# Altium project VESC_6.PrjPcb
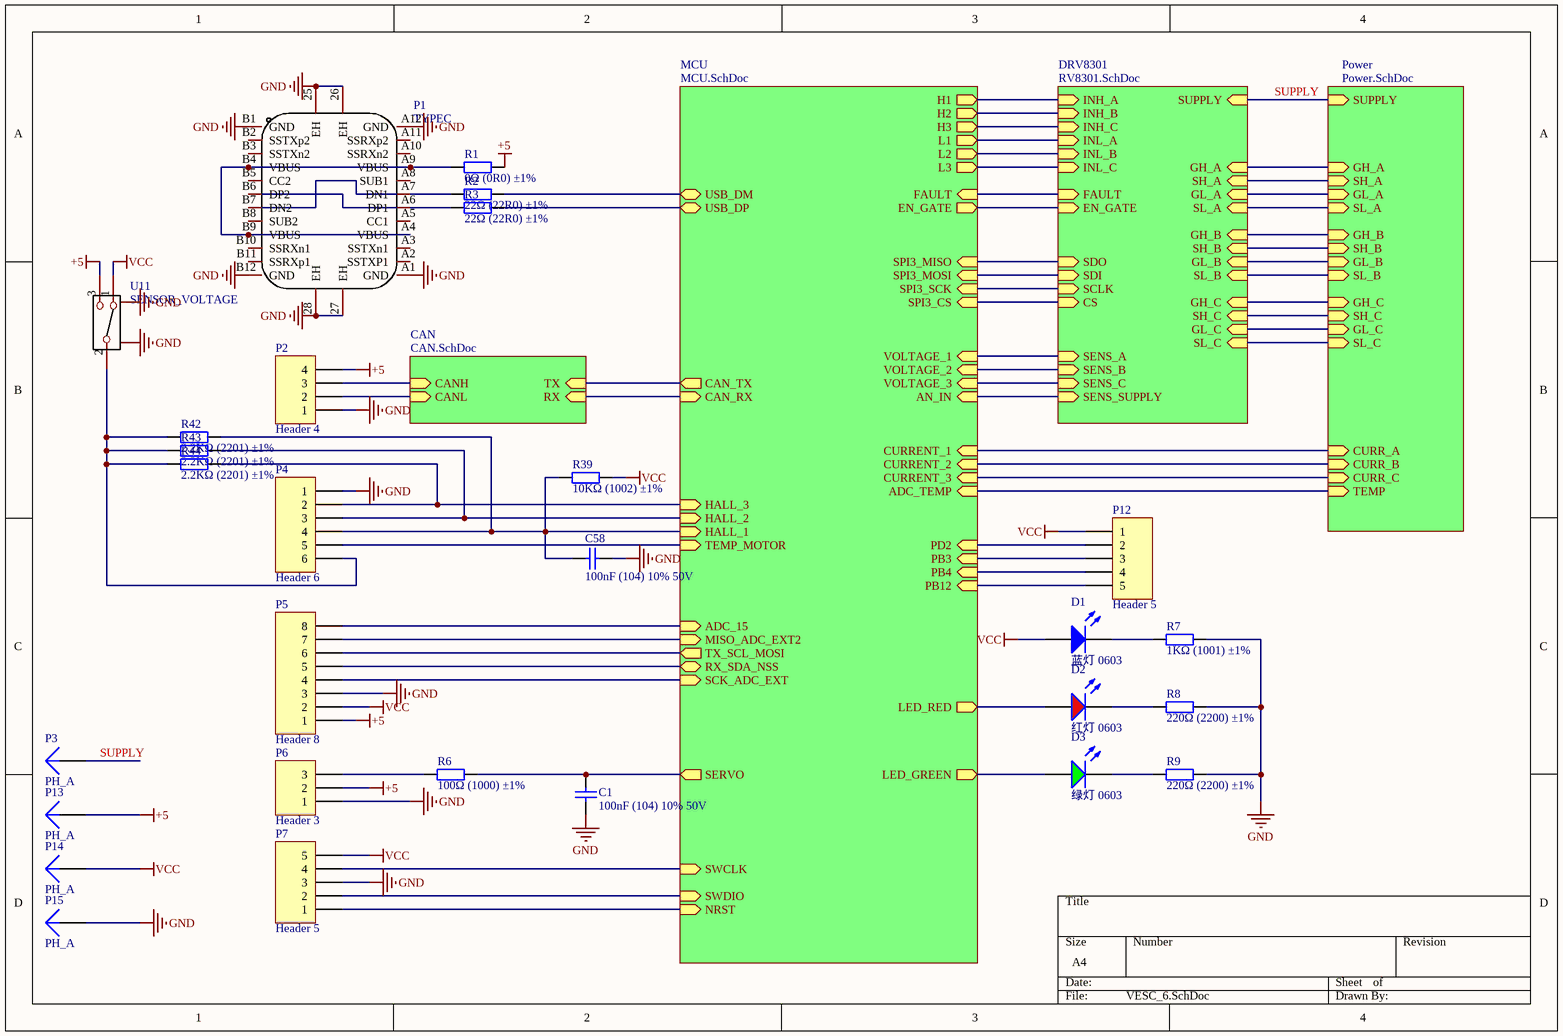
[diagram p0: VESC_6.SchDoc]
5 sheets, 126 parts. Net scope: hierarchical (ports join the sheet entries above them; power ports are global).
Board file: VESC_6.PcbDoc
Sheets:
  VESC_6.SchDoc
    CAN = CAN.SchDoc
    MCU = MCU.SchDoc
    DRV8301 = RV8301.SchDoc
    Power = Power.SchDoc

## Sheet VESC_6.SchDoc
size A4

### Parts
C1  100nF (104) 10% 50V  [0603_C]
C58  100nF (104) 10% 50V  [0603_C]
D1  蓝灯 0603  [0603_LED_S1]
D2  红灯 0603  [0603_LED_S1]
D3  绿灯 0603  [0603_LED_S1]
P1  TYPEC  [USB-C-SMD_TYPE-C-3.1-FEMALE-TH-9.3]
P2  Header 4  [PH-4A]
P3  PH_A  [Test PAD-3MM]
P4  Header 6  [PH-6A]
P5  Header 8  [PH-8A]
P6  Header 3  [PH-3A]
P7  Header 5  [PH-5A]
P12  Header 5  [HDR1X5]
P13  PH_A  [Test PAD-3MM]
P14  PH_A  [Test PAD-3MM]
P15  PH_A  [Test PAD-3MM]
R1  0Ω (0R0) ±1%  [0603_R]
R2  22Ω (22R0) ±1%  [0603_R]
R3  22Ω (22R0) ±1%  [0603_R]
R6  100Ω (1000) ±1%  [0603_R]
R7  1KΩ (1001) ±1%  [0603_R]
R8  220Ω (2200) ±1%  [0603_R]
R9  220Ω (2200) ±1%  [0603_R]
R39  10KΩ (1002) ±1%  [0603_R]
R42  2.2KΩ (2201) ±1%  [0603_R]
R43  2.2KΩ (2201) ±1%  [0603_R]
R44  2.2KΩ (2201) ±1%  [0603_R]
U11  SENSOR_VOLTAGE  [SENSOR_VOLTAGE]

### Sub-sheets
CAN = CAN.SchDoc: CANL (in), CANH (in), RX (in), TX (in)
DRV8301 = RV8301.SchDoc: CS (in), INL_C (in), GL_B (in), SENS_SUPPLY (in), INH_C (in), FAULT (in), SH_A (in), SH_B (in), SENS_B (in), SL_B (in), SCLK (in), SDO (in), GH_B (in), INH_A (in), SL_C (in), INL_A (in), GL_C (in), SENS_A (in), SDI (in), EN_GATE (in), GL_A (in), GH_C (in), INL_B (in), SH_C (in), INH_B (in), SL_A (in), SUPPLY (in), SENS_C (in), GH_A (in)
MCU = MCU.SchDoc: SWCLK (in), SPI3_SCK (in), MISO_ADC_EXT2 (in), LED_RED (out), CAN_RX (in), HALL_1 (in), H2 (out), CURRENT_2 (in), L2 (out), USB_DM (bidir), LED_GREEN (out), SPI3_CS (in), SPI3_MISO (in), FAULT (in), TX_SCL_MOSI (out), PB4 (in), CAN_TX (out), SCK_ADC_EXT (in), L3 (out), SWDIO (in), HALL_2 (in), SPI3_MOSI (in), PD2 (in), EN_GATE (out), ADC_TEMP (in), CURRENT_3 (in), SERVO (out), CURRENT_1 (in), ADC_15 (in), RX_SDA_NSS (bidir), L1 (out), H1 (out), H3 (out), PB3 (in), TEMP_MOTOR (in), HALL_3 (in), PB12 (in), USB_DP (bidir), NRST (in), VOLTAGE_1 (in), VOLTAGE_3 (in), AN_IN (in), VOLTAGE_2 (in)
Power = Power.SchDoc: SUPPLY (in), GH_B (in), SL_B (in), SL_A (in), GL_A (in), CURR_A (in), GL_B (in), SH_B (in), SH_C (in), SH_A (in), CURR_B (in), GH_A (in), SL_C (in), CURR_C (in), GH_C (in), TEMP (in), GL_C (in)

### Nets
+5: C1.1 C58.2 P1.25(EH) P1.26(EH) P1.27(EH) P1.28(EH) P1.A1(GND) P1.A12(GND) P1.B1(GND) P1.B12(GND) P2.1 P2.4 P4.1 P5.1 P5.3 P6.1 P6.2 P7.3 P13.1 P15.1 R1.2 R7.2 R8.2 R9.2 U11.3 U11.4 U11.5 ; sheet DRV8301/SL_B, sheet DRV8301/SL_C, sheet DRV8301/SL_A, sheet Power/SL_B, sheet Power/SL_A, sheet Power/SL_C  [also labelled GND]
VCC: D1.A P5.2 P7.5 P12.1 P14.1 R39.2 U11.1
RX_SDA_NSS: P5.5 ; sheet MCU/RX_SDA_NSS
SH_A: sheet DRV8301/SH_A, sheet Power/SH_A
SH_B: sheet DRV8301/SH_B, sheet Power/SH_B
SH_C: sheet DRV8301/SH_C, sheet Power/SH_C
SUPPLY: P3.1 ; sheet DRV8301/SUPPLY, sheet Power/SUPPLY
TX_SCL_MOSI: P5.6 ; sheet MCU/TX_SCL_MOSI
NetC1_2: C1.2 R6.2 ; sheet MCU/SERVO
NetC7_2: P7.1 ; sheet MCU/NRST
NetC29_2: sheet MCU/CURRENT_1, sheet Power/CURR_A
NetC30_2: sheet MCU/CURRENT_2, sheet Power/CURR_B
NetC36_2: sheet MCU/ADC_TEMP, sheet Power/TEMP
NetC45_2: sheet MCU/CURRENT_3, sheet Power/CURR_C
NetC58_1: C58.1 P4.4 R39.1 R42.2 ; sheet MCU/HALL_1
NetD1_K: D1.K R7.1
NetD2_A: D2.A ; sheet MCU/LED_RED
NetD2_K: D2.K R8.1
NetD3_A: D3.A ; sheet MCU/LED_GREEN
NetD3_K: D3.K R9.1
NetP1_A4: P1.A4(VBUS) P1.A9(VBUS) P1.B4(VBUS) P1.B9(VBUS) R1.1
NetP1_A6: P1.A6(DP1) R3.1
NetP1_A7: P1.A7(DN1) R2.1
NetP2_2: P2.2 ; sheet CAN/CANL
NetP2_3: P2.3 ; sheet CAN/CANH
NetP4_2: P4.2 R44.2 ; sheet MCU/HALL_3
NetP4_3: P4.3 R43.2 ; sheet MCU/HALL_2
NetP4_5: P4.5 ; sheet MCU/TEMP_MOTOR
NetP4_6: P4.6 R42.1 R43.1 R44.1 U11.2
NetP5_4: P5.4 ; sheet MCU/SCK_ADC_EXT
NetP5_7: P5.7 ; sheet MCU/MISO_ADC_EXT2
NetP5_8: P5.8 ; sheet MCU/ADC_15
NetP6_3: P6.3 R6.1
NetP7_2: P7.2 ; sheet MCU/SWDIO
NetP7_4: P7.4 ; sheet MCU/SWCLK
NetP12_2: P12.2 ; sheet MCU/PD2
NetP12_3: P12.3 ; sheet MCU/PB3
NetP12_4: P12.4 ; sheet MCU/PB4
NetP12_5: P12.5 ; sheet MCU/PB12
NetR2_2: R2.2 ; sheet MCU/USB_DM
NetR3_2: R3.2 ; sheet MCU/USB_DP
NetR15_1: sheet MCU/AN_IN, sheet DRV8301/SENS_SUPPLY
NetR17_1: sheet MCU/VOLTAGE_1, sheet DRV8301/SENS_A
NetR19_1: sheet MCU/VOLTAGE_2, sheet DRV8301/SENS_B
NetR21_1: sheet MCU/VOLTAGE_3, sheet DRV8301/SENS_C
NetR25_1: sheet DRV8301/GH_A, sheet Power/GH_A
NetR26_1: sheet DRV8301/GL_A, sheet Power/GL_A
NetR30_1: sheet DRV8301/GH_B, sheet Power/GH_B
NetR31_1: sheet DRV8301/GL_B, sheet Power/GL_B
NetR33_1: sheet DRV8301/GH_C, sheet Power/GH_C
NetR34_1: sheet DRV8301/GL_C, sheet Power/GL_C
NetU1_34: sheet MCU/L1, sheet DRV8301/INL_A
NetU1_35: sheet MCU/L2, sheet DRV8301/INL_B
NetU1_36: sheet MCU/L3, sheet DRV8301/INL_C
NetU1_40: sheet MCU/SPI3_CS, sheet DRV8301/CS
NetU1_41: sheet MCU/H1, sheet DRV8301/INH_A
NetU1_42: sheet MCU/H2, sheet DRV8301/INH_B
NetU1_43: sheet MCU/H3, sheet DRV8301/INH_C
NetU1_51: sheet MCU/SPI3_SCK, sheet DRV8301/SCLK
NetU1_52: sheet MCU/SPI3_MISO, sheet DRV8301/SDO
NetU1_53: sheet MCU/SPI3_MOSI, sheet DRV8301/SDI
NetU1_57: sheet MCU/EN_GATE, sheet DRV8301/EN_GATE
NetU1_59: sheet MCU/FAULT, sheet DRV8301/FAULT
NetU1_61: sheet CAN/RX, sheet MCU/CAN_RX
NetU1_62: sheet CAN/TX, sheet MCU/CAN_TX

Not connected (* = marked no-connect by the designer): P1 A2(SSTXP1) A3(SSTXn1) A5(CC1) A8(SUB1) A10(SSRXn2) A11(SSRXp2) B2(SSTXp2) B3(SSTXn2) B5(CC2) B6(DP2) B7(DN2) B8(SUB2) B10(SSRXn1) B11(SSRXp1)

### Library data of the parts
C1 C58 = 0603 100nF (104) 10% 50V: 贴片电容; ComponentLink1Description: 供应商链接; ComponentLink1URL: http://www.szlcsc.com/product/details_15331.html; Package: 0603; Supplier: LC; SuppliersPartNumber: C14663
D1 = 0603 蓝灯: 发光二极管; ComponentLink1Description: 供应商链接; ComponentLink1URL: http://www.szlcsc.com/product/details_73150.html; Package: 0603; Supplier: LC; SuppliersPartNumber: C72041
D2 = 0603 红灯: 发光二极管; ComponentLink1Description: 供应商链接; ComponentLink1URL: http://www.szlcsc.com/product/details_2659.html; Package: 0603; Supplier: LC; SuppliersPartNumber: C2286
D3 = 0603 绿灯: 发光二极管; ComponentLink1Description: 供应商链接; ComponentLink1URL: http://www.szlcsc.com/product/details_73152.html; Package: 0603; Supplier: LC; SuppliersPartNumber: C72043
P2 = Header 4: Header, 4-Pin; LatestRevisionDate: 17-Jul-2002; LatestRevisionNote: Re-released for DXP Platform.; Publisher: Altium Limited
P3 P13-P15 = Plug: LatestRevisionDate: 17-Jul-2002; LatestRevisionNote: Re-released for DXP Platform.; Publisher: Altium Limited
P4 = Header 6: Header, 6-Pin; LatestRevisionDate: 17-Jul-2002; LatestRevisionNote: Re-released for DXP Platform.; Publisher: Altium Limited
P5 = Header 8: Header, 8-Pin; LatestRevisionDate: 17-Jul-2002; LatestRevisionNote: Re-released for DXP Platform.; Publisher: Altium Limited
P6 = Header 3: Header, 3-Pin; LatestRevisionDate: 17-Jul-2002; LatestRevisionNote: Re-released for DXP Platform.; Publisher: Altium Limited
P7 P12 = Header 5: Header, 5-Pin; LatestRevisionDate: 17-Jul-2002; LatestRevisionNote: Re-released for DXP Platform.; Publisher: Altium Limited
R1 = 0603 0Ω (0R0) 1%: 贴片电阻; ComponentLink1Description: 供应商链接; ComponentLink1URL: http://www.szlcsc.com/product/details_21903.html; Package: 0603; Supplier: LC; SuppliersPartNumber: C21189
R2 R3 = 0603 22Ω (22R0) 1%: 贴片电阻; ComponentLink1Description: 供应商链接; ComponentLink1URL: http://www.szlcsc.com/product/details_24078.html; Package: 0603; Supplier: LC; SuppliersPartNumber: C23345
R6 = 0603 100Ω (1000) 1%: 贴片电阻; ComponentLink1Description: 供应商链接; ComponentLink1URL: http://www.szlcsc.com/product/details_23502.html; Package: 0603; Supplier: LC; SuppliersPartNumber: C22775
R7 = 0603 1KΩ (1001) 1%: 贴片电阻; ComponentLink1Description: 供应商链接; ComponentLink1URL: http://www.szlcsc.com/product/details_21904.html; Package: 0603; Supplier: LC; SuppliersPartNumber: C21190
R8 R9 = 0603 220Ω (2200) 1%: 贴片电阻; ComponentLink1Description: 供应商链接; ComponentLink1URL: http://www.szlcsc.com/product/details_23689.html; Package: 0603; Supplier: LC; SuppliersPartNumber: C22962
R39 = 0603 10KΩ (1002) 1%: 贴片电阻; ComponentLink1Description: 供应商链接; ComponentLink1URL: http://www.szlcsc.com/product/details_26547.html; Package: 0603; Supplier: LC; SuppliersPartNumber: C25804
R42-R44 = 0603 2.2KΩ (2201) 1%: 贴片电阻; ComponentLink1Description: 供应商链接; ComponentLink1URL: http://www.szlcsc.com/product/details_4597.html; Package: 0603; Supplier: LC; SuppliersPartNumber: C4190

## Sheet CAN.SchDoc
size A4
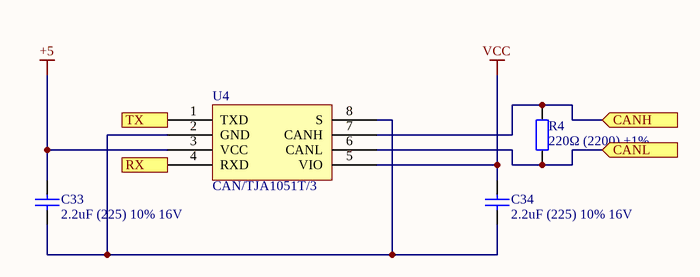
[diagram p1: CAN.SchDoc]

### Parts
C33  2.2uF (225) 10% 16V  [0603_C]
C34  2.2uF (225) 10% 16V  [0603_C]
R4  220Ω (2200) ±1%  [0603_R]
U4  CAN/TJA1051T/3  [SOIC-8_150mil]

### Ports
CANH (in), CANL (in), RX (in), TX (in)

### Nets
+5: C33.2 U4.3(VCC)
VCC: C34.2 U4.5(VIO)
NetC33_1: C33.1 C34.1 U4.2(GND) U4.8(S)
NetP2_2: R4.1 U4.6(CANL) ; port CANL
NetP2_3: R4.2 U4.7(CANH) ; port CANH
NetU1_61: U4.4(RXD) ; port RX
NetU1_62: U4.1(TXD) ; port TX

### Library data of the parts
C33 C34 = 0603 2.2uF (225) 10% 16V: 贴片电容; ComponentLink1Description: 供应商链接; ComponentLink1URL: http://www.szlcsc.com/product/details_24366.html; Package: 0603; Supplier: LC; SuppliersPartNumber: C23630
R4 = 0603 220Ω (2200) 1%: 贴片电阻; ComponentLink1Description: 供应商链接; ComponentLink1URL: http://www.szlcsc.com/product/details_23689.html; Package: 0603; Supplier: LC; SuppliersPartNumber: C22962
U4 = CAN/TJA1051T/3_[C38695]: CAN; ComponentLink1Description: 供应商链接; ComponentLink1URL: http://www.szlcsc.com/product/details_39678.html; Package: SOIC-8_150mil; Supplier: LC; SuppliersPartNumber: C38695

## Sheet MCU.SchDoc
size A4
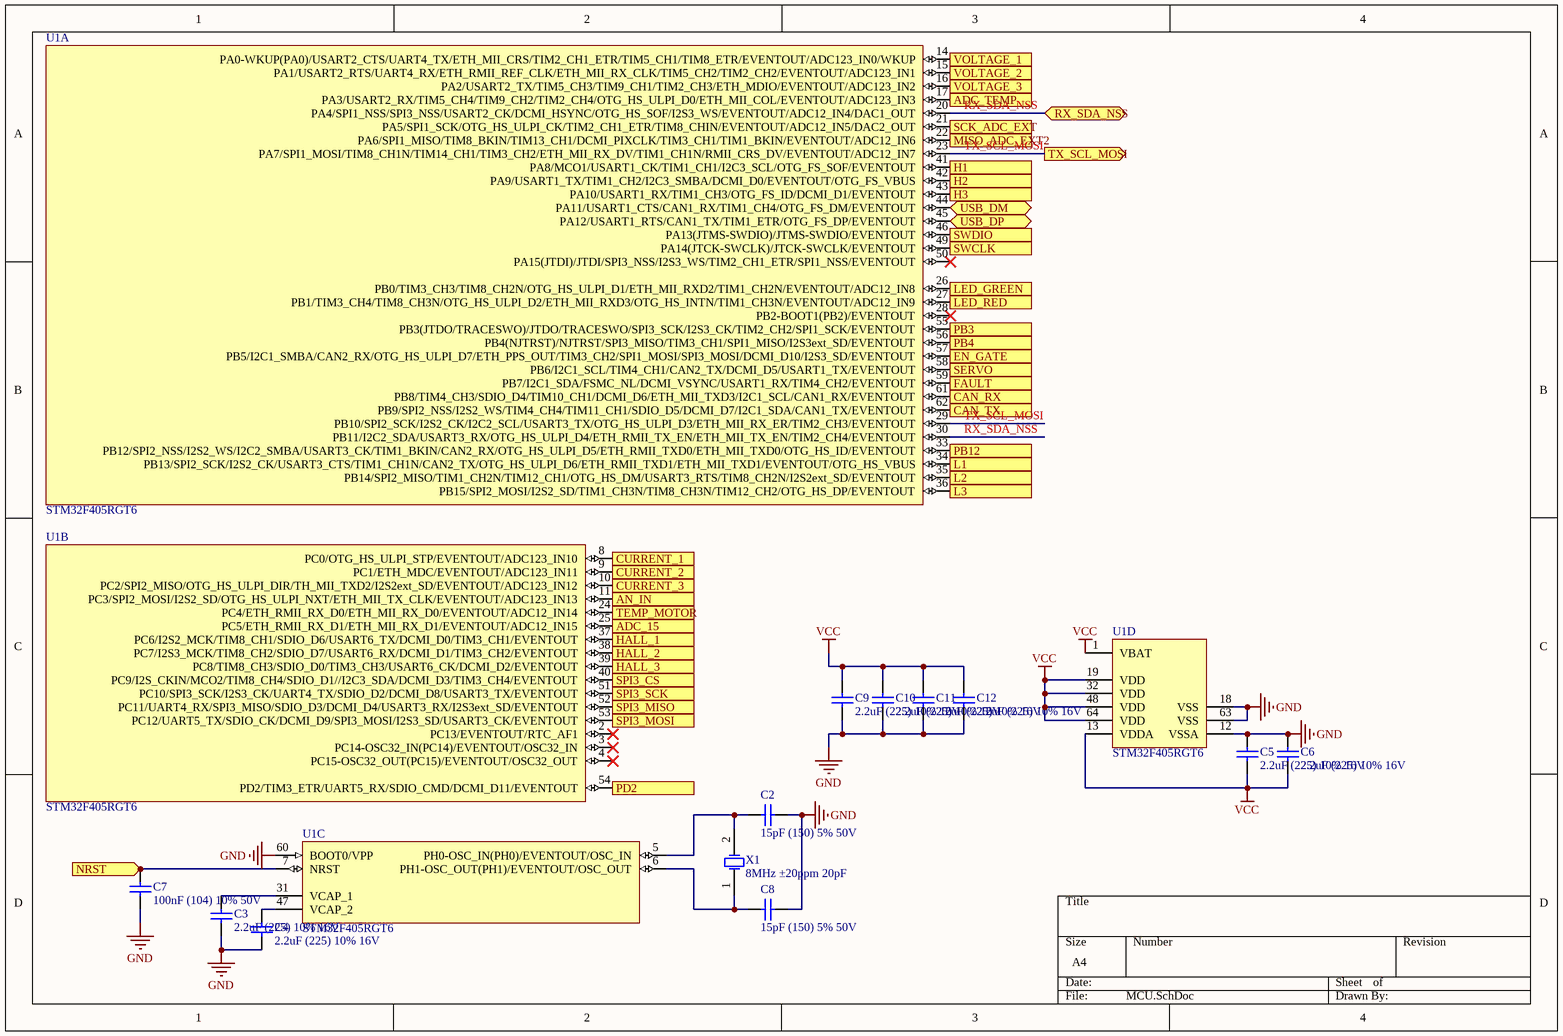
[diagram p2: MCU.SchDoc]

### Parts
C2  15pF (150) 5% 50V  [0603_C]
C3  2.2uF (225) 10% 16V  [0603_C]
C4  2.2uF (225) 10% 16V  [0603_C]
C5  2.2uF (225) 10% 16V  [0603_C]
C6  2.2uF (225) 10% 16V  [0603_C]
C7  100nF (104) 10% 50V  [0603_C]
C8  15pF (150) 5% 50V  [0603_C]
C9  2.2uF (225) 10% 16V  [0603_C]
C10  2.2uF (225) 10% 16V  [0603_C]
C11  2.2uF (225) 10% 16V  [0603_C]
C12  2.2uF (225) 10% 16V  [0603_C]
U1  STM32F405RGT6  [LQFP-64_10x10x05P]  (parts A,B,C,D of 4)
X1  8MHz ±20ppm 20pF  [SMD-5032_2P]

### Ports
ADC_15 (in), ADC_TEMP (in), AN_IN (in), CAN_RX (in), CAN_TX (out), CURRENT_1 (in), CURRENT_2 (in), CURRENT_3 (in), EN_GATE (out), FAULT (in), H1 (out), H2 (out), H3 (out), HALL_1 (in), HALL_2 (in), HALL_3 (in), L1 (out), L2 (out), L3 (out), LED_GREEN (out), LED_RED (out), MISO_ADC_EXT2 (in), NRST (in), PB3 (in), PB4 (in), PB12 (in), PD2 (in), RX_SDA_NSS (bidir), SCK_ADC_EXT (in), SERVO (out), SPI3_CS (in), SPI3_MISO (in), SPI3_MOSI (in), SPI3_SCK (in), SWCLK (in), SWDIO (in), TEMP_MOTOR (in), TX_SCL_MOSI (out), USB_DM (bidir), USB_DP (bidir), VOLTAGE_1 (in), VOLTAGE_2 (in), VOLTAGE_3 (in)

### Nets
GND: C2.2 C3.1 C4.1 C5.2 C6.2 C7.1 C8.2 C9.1 C10.1 C11.1 C12.1 U1.12(VSSA) U1.18(VSS) U1.60(BOOT0/VPP) U1.63(VSS)  [project net +5]
VCC: C5.1 C6.1 C9.2 C10.2 C11.2 C12.2 U1.1(VBAT) U1.13(VDDA) U1.19(VDD) U1.32(VDD) U1.48(VDD) U1.64(VDD)
RX_SDA_NSS: U1.20(PA4/SPI1_NSS/SPI3_NSS/USART2_CK/DCMI_HSYNC/OTG_HS_SOF/I2S3_WS/EVENTOUT/ADC12_IN4/DAC1_OUT) U1.30(PB11/I2C2_SDA/USART3_RX/OTG_HS_ULPI_D4/ETH_RMII_TX_EN/ETH_MII_TX_EN/TIM2_CH4/EVENTOUT) ; port RX_SDA_NSS
TX_SCL_MOSI: U1.23(PA7/SPI1_MOSI/TIM8_CH1N/TIM14_CH1/TIM3_CH2/ETH_MII_RX_DV/TIM1_CH1N/RMII_CRS_DV/EVENTOUT/ADC12_IN7) U1.29(PB10/SPI2_SCK/I2S2_CK/I2C2_SCL/USART3_TX/OTG_HS_ULPI_D3/ETH_MII_RX_ER/TIM2_CH3/EVENTOUT) ; port TX_SCL_MOSI
NetC1_2: U1.58(PB6/I2C1_SCL/TIM4_CH1/CAN2_TX/DCMI_D5/USART1_TX/EVENTOUT) ; port SERVO
NetC2_1: C2.1 U1.5(PH0-OSC_IN(PH0)/EVENTOUT/OSC_IN) X1.2(OSC2)
NetC3_2: C3.2 U1.31(VCAP_1)
NetC4_2: C4.2 U1.47(VCAP_2)
NetC7_2: C7.2 U1.7(NRST) ; port NRST
NetC8_1: C8.1 U1.6(PH1-OSC_OUT(PH1)/EVENTOUT/OSC_OUT) X1.1(OSC1)
NetC29_2: U1.8(PC0/OTG_HS_ULPI_STP/EVENTOUT/ADC123_IN10) ; port CURRENT_1
NetC30_2: U1.9(PC1/ETH_MDC/EVENTOUT/ADC123_IN11) ; port CURRENT_2
NetC36_2: U1.17(PA3/USART2_RX/TIM5_CH4/TIM9_CH2/TIM2_CH4/OTG_HS_ULPI_D0/ETH_MII_COL/EVENTOUT/ADC123_IN3) ; port ADC_TEMP
NetC45_2: U1.10(PC2/SPI2_MISO/OTG_HS_ULPI_DIR/TH_MII_TXD2/I2S2ext_SD/EVENTOUT/ADC123_IN12) ; port CURRENT_3
NetC58_1: U1.37(PC6/I2S2_MCK/TIM8_CH1/SDIO_D6/USART6_TX/DCMI_D0/TIM3_CH1/EVENTOUT) ; port HALL_1
NetD2_A: U1.27(PB1/TIM3_CH4/TIM8_CH3N/OTG_HS_ULPI_D2/ETH_MII_RXD3/OTG_HS_INTN/TIM1_CH3N/EVENTOUT/ADC12_IN9) ; port LED_RED
NetD3_A: U1.26(PB0/TIM3_CH3/TIM8_CH2N/OTG_HS_ULPI_D1/ETH_MII_RXD2/TIM1_CH2N/EVENTOUT/ADC12_IN8) ; port LED_GREEN
NetP4_2: U1.39(PC8/TIM8_CH3/SDIO_D0/TIM3_CH3/USART6_CK/DCMI_D2/EVENTOUT) ; port HALL_3
NetP4_3: U1.38(PC7/I2S3_MCK/TIM8_CH2/SDIO_D7/USART6_RX/DCMI_D1/TIM3_CH2/EVENTOUT) ; port HALL_2
NetP4_5: U1.24(PC4/ETH_RMII_RX_D0/ETH_MII_RX_D0/EVENTOUT/ADC12_IN14) ; port TEMP_MOTOR
NetP5_4: U1.21(PA5/SPI1_SCK/OTG_HS_ULPI_CK/TIM2_CH1_ETR/TIM8_CHIN/EVENTOUT/ADC12_IN5/DAC2_OUT) ; port SCK_ADC_EXT
NetP5_7: U1.22(PA6/SPI1_MISO/TIM8_BKIN/TIM13_CH1/DCMI_PIXCLK/TIM3_CH1/TIM1_BKIN/EVENTOUT/ADC12_IN6) ; port MISO_ADC_EXT2
NetP5_8: U1.25(PC5/ETH_RMII_RX_D1/ETH_MII_RX_D1/EVENTOUT/ADC12_IN15) ; port ADC_15
NetP7_2: U1.46(PA13(JTMS-SWDIO)/JTMS-SWDIO/EVENTOUT) ; port SWDIO
NetP7_4: U1.49(PA14(JTCK-SWCLK)/JTCK-SWCLK/EVENTOUT) ; port SWCLK
NetP12_2: U1.54(PD2/TIM3_ETR/UART5_RX/SDIO_CMD/DCMI_D11/EVENTOUT) ; port PD2
NetP12_3: U1.55(PB3(JTDO/TRACESWO)/JTDO/TRACESWO/SPI3_SCK/I2S3_CK/TIM2_CH2/SPI1_SCK/EVENTOUT) ; port PB3
NetP12_4: U1.56(PB4(NJTRST)/NJTRST/SPI3_MISO/TIM3_CH1/SPI1_MISO/I2S3ext_SD/EVENTOUT) ; port PB4
NetP12_5: U1.33(PB12/SPI2_NSS/I2S2_WS/I2C2_SMBA/USART3_CK/TIM1_BKIN/CAN2_RX/OTG_HS_ULPI_D5/ETH_RMII_TXD0/ETH_MII_TXD0/OTG_HS_ID/EVENTOUT) ; port PB12
NetR2_2: U1.44(PA11/USART1_CTS/CAN1_RX/TIM1_CH4/OTG_FS_DM/EVENTOUT) ; port USB_DM
NetR3_2: U1.45(PA12/USART1_RTS/CAN1_TX/TIM1_ETR/OTG_FS_DP/EVENTOUT) ; port USB_DP
NetR15_1: U1.11(PC3/SPI2_MOSI/I2S2_SD/OTG_HS_ULPI_NXT/ETH_MII_TX_CLK/EVENTOUT/ADC123_IN13) ; port AN_IN
NetR17_1: U1.14(PA0-WKUP(PA0)/USART2_CTS/UART4_TX/ETH_MII_CRS/TIM2_CH1_ETR/TIM5_CH1/TIM8_ETR/EVENTOUT/ADC123_IN0/WKUP) ; port VOLTAGE_1
NetR19_1: U1.15(PA1/USART2_RTS/UART4_RX/ETH_RMII_REF_CLK/ETH_MII_RX_CLK/TIM5_CH2/TIM2_CH2/EVENTOUT/ADC123_IN1) ; port VOLTAGE_2
NetR21_1: U1.16(PA2/USART2_TX/TIM5_CH3/TIM9_CH1/TIM2_CH3/ETH_MDIO/EVENTOUT/ADC123_IN2) ; port VOLTAGE_3
NetU1_34: U1.34(PB13/SPI2_SCK/I2S2_CK/USART3_CTS/TIM1_CH1N/CAN2_TX/OTG_HS_ULPI_D6/ETH_RMII_TXD1/ETH_MII_TXD1/EVENTOUT/OTG_HS_VBUS) ; port L1
NetU1_35: U1.35(PB14/SPI2_MISO/TIM1_CH2N/TIM12_CH1/OTG_HS_DM/USART3_RTS/TIM8_CH2N/I2S2ext_SD/EVENTOUT) ; port L2
NetU1_36: U1.36(PB15/SPI2_MOSI/I2S2_SD/TIM1_CH3N/TIM8_CH3N/TIM12_CH2/OTG_HS_DP/EVENTOUT) ; port L3
NetU1_40: U1.40(PC9/I2S_CKIN/MCO2/TIM8_CH4/SDIO_D1//I2C3_SDA/DCMI_D3/TIM3_CH4/EVENTOUT) ; port SPI3_CS
NetU1_41: U1.41(PA8/MCO1/USART1_CK/TIM1_CH1/I2C3_SCL/OTG_FS_SOF/EVENTOUT) ; port H1
NetU1_42: U1.42(PA9/USART1_TX/TIM1_CH2/I2C3_SMBA/DCMI_D0/EVENTOUT/OTG_FS_VBUS) ; port H2
NetU1_43: U1.43(PA10/USART1_RX/TIM1_CH3/OTG_FS_ID/DCMI_D1/EVENTOUT) ; port H3
NetU1_51: U1.51(PC10/SPI3_SCK/I2S3_CK/UART4_TX/SDIO_D2/DCMI_D8/USART3_TX/EVENTOUT) ; port SPI3_SCK
NetU1_52: U1.52(PC11/UART4_RX/SPI3_MISO/SDIO_D3/DCMI_D4/USART3_RX/I2S3ext_SD/EVENTOUT) ; port SPI3_MISO
NetU1_53: U1.53(PC12/UART5_TX/SDIO_CK/DCMI_D9/SPI3_MOSI/I2S3_SD/USART3_CK/EVENTOUT) ; port SPI3_MOSI
NetU1_57: U1.57(PB5/I2C1_SMBA/CAN2_RX/OTG_HS_ULPI_D7/ETH_PPS_OUT/TIM3_CH2/SPI1_MOSI/SPI3_MOSI/DCMI_D10/I2S3_SD/EVENTOUT) ; port EN_GATE
NetU1_59: U1.59(PB7/I2C1_SDA/FSMC_NL/DCMI_VSYNC/USART1_RX/TIM4_CH2/EVENTOUT) ; port FAULT
NetU1_61: U1.61(PB8/TIM4_CH3/SDIO_D4/TIM10_CH1/DCMI_D6/ETH_MII_TXD3/I2C1_SCL/CAN1_RX/EVENTOUT) ; port CAN_RX
NetU1_62: U1.62(PB9/SPI2_NSS/I2S2_WS/TIM4_CH4/TIM11_CH1/SDIO_D5/DCMI_D7/I2C1_SDA/CAN1_TX/EVENTOUT) ; port CAN_TX

Not connected (* = marked no-connect by the designer): U1 2(PC13/EVENTOUT/RTC_AF1)* 3(PC14-OSC32_IN(PC14)/EVENTOUT/OSC32_IN)* 4(PC15-OSC32_OUT(PC15)/EVENTOUT/OSC32_OUT)* 28(PB2-BOOT1(PB2)/EVENTOUT)* 50(PA15(JTDI)/JTDI/SPI3_NSS/I2S3_WS/TIM2_CH1_ETR/SPI1_NSS/EVENTOUT)*

### Library data of the parts
C2 C8 = 0603 15pF (150) 5% 50V: 贴片电容; ComponentLink1Description: 供应商链接; ComponentLink1URL: http://www.szlcsc.com/product/details_1996.html; Package: 0603; Supplier: LC; SuppliersPartNumber: C1644
C3-C6 C9-C12 = 0603 2.2uF (225) 10% 16V: 贴片电容; ComponentLink1Description: 供应商链接; ComponentLink1URL: http://www.szlcsc.com/product/details_24366.html; Package: 0603; Supplier: LC; SuppliersPartNumber: C23630
C7 = 0603 100nF (104) 10% 50V: 贴片电容; ComponentLink1Description: 供应商链接; ComponentLink1URL: http://www.szlcsc.com/product/details_15331.html; Package: 0603; Supplier: LC; SuppliersPartNumber: C14663
U1 = STM32F405RGT6: ARM; ComponentLink1Description: 供应商链接; ComponentLink1URL: http://www.szlcsc.com/product/details_16424.html; Package: LQFP-64_10x10x05P; Supplier: LC; SuppliersPartNumber: C15742
X1 = SMD-5032_2P 8MHz 20ppm 20pF: 贴片晶振; ComponentLink1Description: 供应商链接; ComponentLink1URL: http://www.szlcsc.com/product/details_117214.html; Package: SMD-5032_2P; Supplier: LC; SuppliersPartNumber: C115962

## Sheet RV8301.SchDoc
size A4
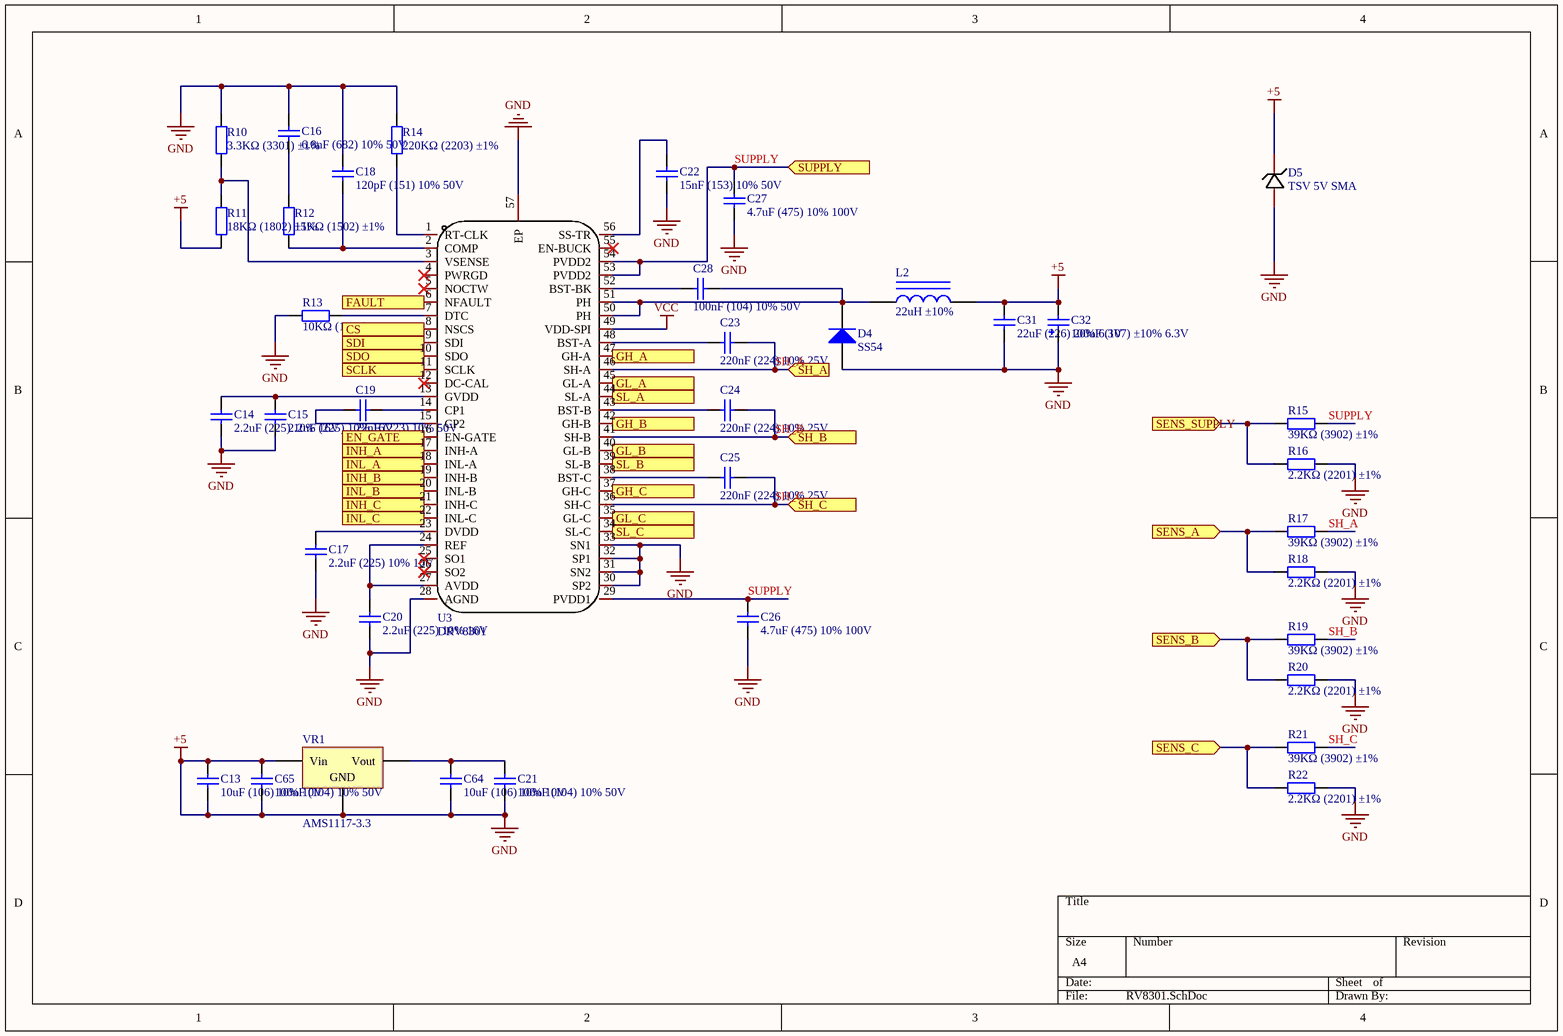
[diagram p3: RV8301.SchDoc]

### Parts
C13  10uF (106) 10% 10V  [0603_C]
C14  2.2uF (225) 10% 16V  [0603_C]
C15  2.2uF (225) 10% 16V  [0603_C]
C16  6.8nF (682) 10% 50V  [0603_C]
C17  2.2uF (225) 10% 16V  [0603_C]
C18  120pF (151) 10% 50V  [0603_C]
C19  22nF (223) 10% 50V  [0603_C]
C20  2.2uF (225) 10% 16V  [0603_C]
C21  100nF (104) 10% 50V  [0603_C]
C22  15nF (153) 10% 50V  [0603_C]
C23  220nF (224) 10% 25V  [0603_C]
C24  220nF (224) 10% 25V  [0603_C]
C25  220nF (224) 10% 25V  [0603_C]
C26  4.7uF (475) 10% 100V  [1210_C]
C27  4.7uF (475) 10% 100V  [1210_C]
C28  100nF (104) 10% 50V  [0603_C]
C31  22uF (226) 20% 6.3V  [0603_C]
C32  100uF (107) ±10% 6.3V  [CASE-B_3528]
C64  10uF (106) 10% 10V  [0603_C]
C65  100nF (104) 10% 50V  [0603_C]
D4  SS54  [SMA(DO-214AC)_S1]
D5  TSV 5V SMA  [TSV 5V SMA]
L2  22uH ±10%  [22uh3A]
R10  3.3KΩ (3301) ±1%  [0603_R]
R11  18KΩ (1802) ±1%  [0603_R]
R12  15KΩ (1502) ±1%  [0603_R]
R13  10KΩ (1002) ±1%  [0603_R]
R14  220KΩ (2203) ±1%  [0603_R]
R15  39KΩ (3902) ±1%  [0603_R]
R16  2.2KΩ (2201) ±1%  [0603_R]
R17  39KΩ (3902) ±1%  [0603_R]
R18  2.2KΩ (2201) ±1%  [0603_R]
R19  39KΩ (3902) ±1%  [0603_R]
R20  2.2KΩ (2201) ±1%  [0603_R]
R21  39KΩ (3902) ±1%  [0603_R]
R22  2.2KΩ (2201) ±1%  [0603_R]
U3  DRV8301  [DRV8301]
VR1  AMS1117-3.3  [SOT-223]

### Ports
CS (in), EN_GATE (in), FAULT (in), GH_A (in), GH_B (in), GH_C (in), GL_A (in), GL_B (in), GL_C (in), INH_A (in), INH_B (in), INH_C (in), INL_A (in), INL_B (in), INL_C (in), SCLK (in), SDI (in), SDO (in), SENS_A (in), SENS_B (in), SENS_C (in), SENS_SUPPLY (in), SH_A (in), SH_B (in), SH_C (in), SL_A (in), SL_B (in), SL_C (in), SUPPLY (in)

### Nets
+5: C13.1 C13.2 C14.1 C15.1 C16.2 C17.1 C18.2 C20.1 C21.1 C22.1 C26.1 C27.1 C31.1 C31.2 C32.1 C32.2 C64.1 C65.1 C65.2 D4.1(A) D5.1(C) D5.2(A) L2.2 R10.2 R11.1 R13.1 R14.2 R16.2 R18.2 R20.2 R22.2 U3.28(AGND) U3.30(SP2) U3.31(SN2) U3.32(SP1) U3.33(SN1) U3.34(SL-C) U3.39(SL-B) U3.44(SL-A) U3.57(EP) VR1.1(GND) VR1.3(Vin) ; port SL_A, port SL_B, port SL_C  [also labelled GND]
VCC: U3.49(VDD-SPI)
SH_A: C23.2 R17.2 U3.46(SH-A) ; port SH_A
SH_B: C24.2 R19.2 U3.41(SH-B) ; port SH_B
SH_C: C25.2 R21.2 U3.36(SH-C) ; port SH_C
SUPPLY: C26.2 C27.2 R15.2 U3.29(PVDD1) U3.53(PVDD2) U3.54(PVDD2) ; port SUPPLY
NetC14_2: C14.2 C15.2 U3.13(GVDD)
NetC16_1: C16.1 R12.2
NetC17_2: C17.2 U3.23(DVDD)
NetC18_1: C18.1 R12.1 U3.2(COMP)
NetC19_1: C19.1 U3.15(CP2)
NetC19_2: C19.2 U3.14(CP1)
NetC20_2: C20.2 U3.24(REF) U3.27(AVDD)
NetC21_2: C21.2 C64.2 VR1.2(Vout)
NetC22_2: C22.2 U3.56(SS-TR)
NetC23_1: C23.1 U3.48(BST-A)
NetC24_1: C24.1 U3.43(BST-B)
NetC25_1: C25.1 U3.38(BST-C)
NetC28_1: C28.1 U3.52(BST-BK)
NetC28_2: C28.2 D4.2(K) L2.1 U3.50(PH) U3.51(PH)
NetR10_1: R10.1 R11.2 U3.3(VSENSE)
NetR13_2: R13.2 U3.7(DTC)
NetR14_1: R14.1 U3.1(RT-CLK)
NetR15_1: R15.1 R16.1 ; port SENS_SUPPLY
NetR17_1: R17.1 R18.1 ; port SENS_A
NetR19_1: R19.1 R20.1 ; port SENS_B
NetR21_1: R21.1 R22.1 ; port SENS_C
NetR25_1: U3.47(GH-A) ; port GH_A
NetR26_1: U3.45(GL-A) ; port GL_A
NetR30_1: U3.42(GH-B) ; port GH_B
NetR31_1: U3.40(GL-B) ; port GL_B
NetR33_1: U3.37(GH-C) ; port GH_C
NetR34_1: U3.35(GL-C) ; port GL_C
NetU1_34: U3.18(INL-A) ; port INL_A
NetU1_35: U3.20(INL-B) ; port INL_B
NetU1_36: U3.22(INL-C) ; port INL_C
NetU1_40: U3.8(NSCS) ; port CS
NetU1_41: U3.17(INH-A) ; port INH_A
NetU1_42: U3.19(INH-B) ; port INH_B
NetU1_43: U3.21(INH-C) ; port INH_C
NetU1_51: U3.11(SCLK) ; port SCLK
NetU1_52: U3.10(SDO) ; port SDO
NetU1_53: U3.9(SDI) ; port SDI
NetU1_57: U3.16(EN-GATE) ; port EN_GATE
NetU1_59: U3.6(NFAULT) ; port FAULT

Not connected (* = marked no-connect by the designer): U3 4(PWRGD)* 5(NOCTW)* 12(DC-CAL)* 25(SO1)* 26(SO2)* 55(EN-BUCK)*

### Library data of the parts
C13 C64 = 0603 10uF (106) 10% 10V: 贴片电容; ComponentLink1Description: 供应商链接; ComponentLink1URL: http://www.szlcsc.com/product/details_20411.html; Package: 0603; Supplier: LC; SuppliersPartNumber: C19702
C14 C15 C17 C20 = 0603 2.2uF (225) 10% 16V: 贴片电容; ComponentLink1Description: 供应商链接; ComponentLink1URL: http://www.szlcsc.com/product/details_24366.html; Package: 0603; Supplier: LC; SuppliersPartNumber: C23630
C16 = 0603 6.8nF (682) 10% 50V: 贴片电容; ComponentLink1Description: 供应商链接; ComponentLink1URL: http://www.szlcsc.com/product/details_1983.html; Package: 0603; Supplier: LC; SuppliersPartNumber: C1631
C18 = 0603 150pF (151) 10% 50V: 贴片电容; ComponentLink1Description: 供应商链接; ComponentLink1URL: http://www.szlcsc.com/product/details_1946.html; Package: 0603; Supplier: LC; SuppliersPartNumber: C1594
C19 = 0603 22nF (223) 10% 50V: 贴片电容; ComponentLink1Description: 供应商链接; ComponentLink1URL: http://www.szlcsc.com/product/details_21834.html; Package: 0603; Supplier: LC; SuppliersPartNumber: C21122
C21 C28 C65 = 0603 100nF (104) 10% 50V: 贴片电容; ComponentLink1Description: 供应商链接; ComponentLink1URL: http://www.szlcsc.com/product/details_15331.html; Package: 0603; Supplier: LC; SuppliersPartNumber: C14663
C22 = 0603 15nF (153) 10% 50V: 贴片电容; ComponentLink1Description: 供应商链接; ComponentLink1URL: http://www.szlcsc.com/product/details_1948.html; Package: 0603; Supplier: LC; SuppliersPartNumber: C1596
C23-C25 = 0603 220nF (224) 10% 25V: 贴片电容; ComponentLink1Description: 供应商链接; ComponentLink1URL: http://www.szlcsc.com/product/details_21832.html; Package: 0603; Supplier: LC; SuppliersPartNumber: C21120
C26 C27 = 0603 4.7uF (475) 10% 16V: 贴片电容; ComponentLink1Description: 供应商链接; ComponentLink1URL: http://www.szlcsc.com/product/details_20375.html; Package: 0603; Supplier: LC; SuppliersPartNumber: C19666
C31 = 0603 22uF (226) 20% 6.3V: 贴片电容; ComponentLink1Description: 供应商链接; ComponentLink1URL: http://www.szlcsc.com/product/details_60514.html; Package: 0603; Supplier: LC; SuppliersPartNumber: C59461
C32 = 3528 100uF (107) 10% 6.3V: 钽电容; ComponentLink1Description: 供应商链接; ComponentLink1URL: http://www.szlcsc.com/product/details_16815.html; Package: 3528; Supplier: LC; SuppliersPartNumber: C16133
D4 = SMA(DO-214AC) SS54: 二极管; ComponentLink1Description: 供应商链接; ComponentLink1URL: http://www.szlcsc.com/product/details_23178.html; Package: SMA(DO-214AC); Supplier: LC; SuppliersPartNumber: C22452
L2 = 0805 22uH 10%: 贴片电感; ComponentLink1Description: 供应商链接; ComponentLink1URL: http://www.szlcsc.com/product/details_33340.html; Package: 0805; Supplier: LC; SuppliersPartNumber: C32375
R10 = 0603 3.3KΩ (3301) 1%: 贴片电阻; ComponentLink1Description: 供应商链接; ComponentLink1URL: http://www.szlcsc.com/product/details_23705.html; Package: 0603; Supplier: LC; SuppliersPartNumber: C22978
R11 = 0603 18KΩ (1802) 1%: 贴片电阻; ComponentLink1Description: 供应商链接; ComponentLink1URL: http://www.szlcsc.com/product/details_26553.html; Package: 0603; Supplier: LC; SuppliersPartNumber: C25810
R12 = 0603 15KΩ (1502) 1%: 贴片电阻; ComponentLink1Description: 供应商链接; ComponentLink1URL: http://www.szlcsc.com/product/details_23536.html; Package: 0603; Supplier: LC; SuppliersPartNumber: C22809
R13 = 0603 10KΩ (1002) 1%: 贴片电阻; ComponentLink1Description: 供应商链接; ComponentLink1URL: http://www.szlcsc.com/product/details_26547.html; Package: 0603; Supplier: LC; SuppliersPartNumber: C25804
R14 = 0603 220KΩ (2203) 1%: 贴片电阻; ComponentLink1Description: 供应商链接; ComponentLink1URL: http://www.szlcsc.com/product/details_23688.html; Package: 0603; Supplier: LC; SuppliersPartNumber: C22961
R15 R17 R19 R21 = 0603 39KΩ (3902) 1%: 贴片电阻; ComponentLink1Description: 供应商链接; ComponentLink1URL: http://www.szlcsc.com/product/details_23880.html; Package: 0603; Supplier: LC; SuppliersPartNumber: C23153
R16 R18 R20 R22 = 0603 2.2KΩ (2201) 1%: 贴片电阻; ComponentLink1Description: 供应商链接; ComponentLink1URL: http://www.szlcsc.com/product/details_4597.html; Package: 0603; Supplier: LC; SuppliersPartNumber: C4190
VR1 = SOT-223 AMS1117-3.3: 低压差线性稳压(LDO); ComponentLink1Description: 供应商链接; ComponentLink1URL: http://www.szlcsc.com/product/details_6652.html; Package: SOT-223; Supplier: LC; SuppliersPartNumber: C6186

## Sheet Power.SchDoc
size A4
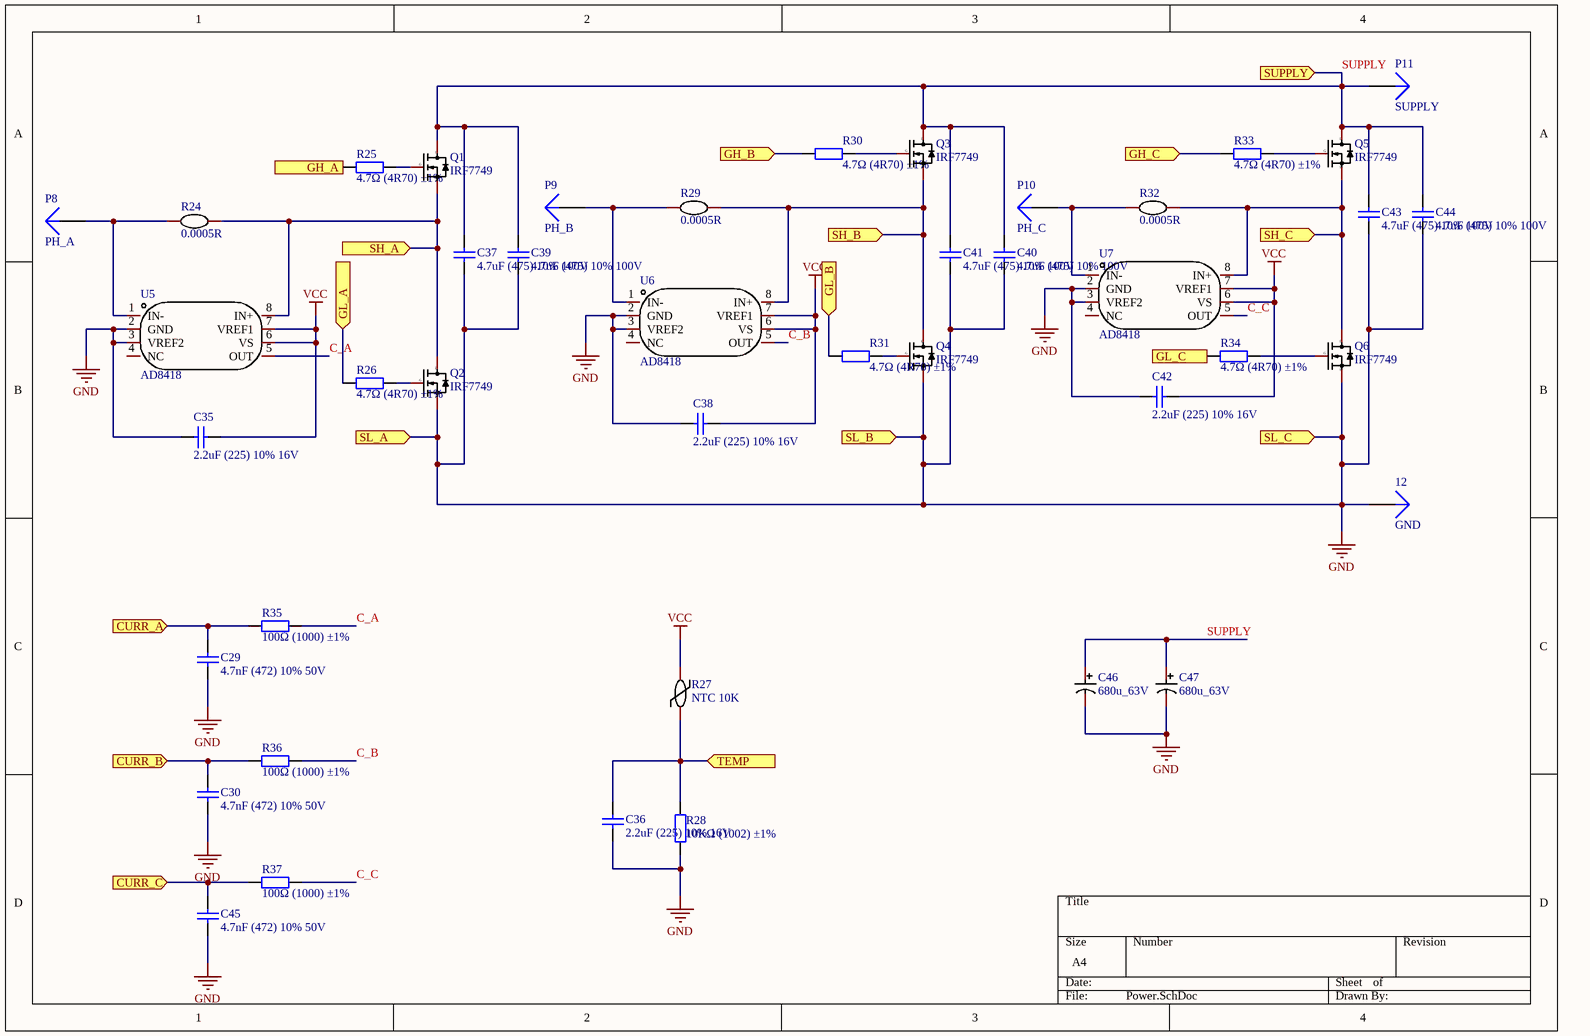
[diagram p4: Power.SchDoc]

### Parts
12  GND  [Power PAD6x6]
C29  4.7nF (472) 10% 50V  [0603_C]
C30  4.7nF (472) 10% 50V  [0603_C]
C35  2.2uF (225) 10% 16V  [0603_C]
C36  2.2uF (225) 10% 16V  [0603_C]
C37  4.7uF (475) 10% 100V  [1210_C]
C38  2.2uF (225) 10% 16V  [0603_C]
C39  4.7uF (475) 10% 100V  [1210_C]
C40  4.7uF (475) 10% 100V  [1210_C]
C41  4.7uF (475) 10% 100V  [1210_C]
C42  2.2uF (225) 10% 16V  [0603_C]
C43  4.7uF (475) 10% 100V  [1210_C]
C44  4.7uF (475) 10% 100V  [1210_C]
C45  4.7nF (472) 10% 50V  [0603_C]
C46  680u_63V  [680u_63V]
C47  680u_63V  [680u_63V]
P8  PH_A  [POWER PAD]
P9  PH_B  [POWER PAD]
P10  PH_C  [POWER PAD]
P11  SUPPLY  [Power PAD6x6]
Q1  IRF7749  [IRF7749]
Q2  IRF7749  [IRF7749]
Q3  IRF7749  [IRF7749]
Q4  IRF7749  [IRF7749]
Q5  IRF7749  [IRF7749]
Q6  IRF7749  [IRF7749]
R24  0.0005R  [0.0005R]
R25  4.7Ω (4R70) ±1%  [0603_R]
R26  4.7Ω (4R70) ±1%  [0603_R]
R27  NTC 10K  [NTC 10K]
R28  10KΩ (1002) ±1%  [0603_R]
R29  0.0005R  [0.0005R]
R30  4.7Ω (4R70) ±1%  [0603_R]
R31  4.7Ω (4R70) ±1%  [0603_R]
R32  0.0005R  [0.0005R]
R33  4.7Ω (4R70) ±1%  [0603_R]
R34  4.7Ω (4R70) ±1%  [0603_R]
R35  100Ω (1000) ±1%  [0603_R]
R36  100Ω (1000) ±1%  [0603_R]
R37  100Ω (1000) ±1%  [0603_R]
U5  AD8418  [AD8418]
U6  AD8418  [AD8418]
U7  AD8418  [AD8418]

### Ports
CURR_A (in), CURR_B (in), CURR_C (in), GH_A (in), GH_B (in), GH_C (in), GL_A (in), GL_B (in), GL_C (in), SH_A (in), SH_B (in), SH_C (in), SL_A (in), SL_B (in), SL_C (in), SUPPLY (in), TEMP (in)

### Nets
GND: 12.1 C29.1 C30.1 C35.1 C36.1 C37.1 C38.1 C39.1 C40.1 C41.1 C42.1 C43.1 C44.1 C45.1 C46.2 C47.2 Q2.3(S) Q4.3(S) Q6.3(S) R28.1 U5.2(GND) U5.3(VREF2) U6.2(GND) U6.3(VREF2) U7.2(GND) U7.3(VREF2) ; port SL_A, port SL_B, port SL_C  [project net +5]
VCC: C35.2 C38.2 C42.2 R27.2 U5.6(VS) U5.7(VREF1) U6.6(VS) U6.7(VREF1) U7.6(VS) U7.7(VREF1)
C_A: R35.2 U5.5(OUT)
C_B: R36.2 U6.5(OUT)
C_C: R37.2 U7.5(OUT)
SH_A: Q1.3(S) Q2.4(D) R24.2 U5.8(IN+) ; port SH_A
SH_B: Q3.3(S) Q4.4(D) R29.2 U6.8(IN+) ; port SH_B
SH_C: Q5.3(S) Q6.4(D) R32.2 U7.8(IN+) ; port SH_C
SUPPLY: C37.2 C39.2 C40.2 C41.2 C43.2 C44.2 C46.1 C47.1 P11.1 Q1.4(D) Q3.4(D) Q5.4(D) ; port SUPPLY
NetC29_2: C29.2 R35.1 ; port CURR_A
NetC30_2: C30.2 R36.1 ; port CURR_B
NetC36_2: C36.2 R27.1 R28.2 ; port TEMP
NetC45_2: C45.2 R37.1 ; port CURR_C
NetP8_1: P8.1 R24.1 U5.1(IN-)
NetP9_1: P9.1 R29.1 U6.1(IN-)
NetP10_1: P10.1 R32.1 U7.1(IN-)
NetQ1_1: Q1.1(G) R25.2
NetQ2_1: Q2.1(G) R26.2
NetQ3_1: Q3.1(G) R30.2
NetQ4_1: Q4.1(G) R31.2
NetQ5_1: Q5.1(G) R33.2
NetQ6_1: Q6.1(G) R34.2
NetR25_1: R25.1 ; port GH_A
NetR26_1: R26.1 ; port GL_A
NetR30_1: R30.1 ; port GH_B
NetR31_1: R31.1 ; port GL_B
NetR33_1: R33.1 ; port GH_C
NetR34_1: R34.1 ; port GL_C

Not connected (* = marked no-connect by the designer): U5 4(NC); U6 4(NC); U7 4(NC)

### Library data of the parts
12 P8-P11 = Plug: LatestRevisionDate: 17-Jul-2002; LatestRevisionNote: Re-released for DXP Platform.; Publisher: Altium Limited
C29 C30 C45 = 0603 4.7nF (472) 10% 50V: 贴片电容; ComponentLink1Description: 供应商链接; ComponentLink1URL: http://www.szlcsc.com/product/details_55004.html; Package: 0603; Supplier: LC; SuppliersPartNumber: C53987
C35 C36 C38 C42 = 0603 2.2uF (225) 10% 16V: 贴片电容; ComponentLink1Description: 供应商链接; ComponentLink1URL: http://www.szlcsc.com/product/details_24366.html; Package: 0603; Supplier: LC; SuppliersPartNumber: C23630
C37 C39-C41 C43 C44 = 0603 4.7uF (475) 10% 16V: 贴片电容; ComponentLink1Description: 供应商链接; ComponentLink1URL: http://www.szlcsc.com/product/details_20375.html; Package: 0603; Supplier: LC; SuppliersPartNumber: C19666
R25 R26 R30 R31 R33 R34 = 0603 4.7Ω (4R70) 1%: 贴片电阻; ComponentLink1Description: 供应商链接; ComponentLink1URL: http://www.szlcsc.com/product/details_23891.html; Package: 0603; Supplier: LC; SuppliersPartNumber: C23164
R28 = 0603 10KΩ (1002) 1%: 贴片电阻; ComponentLink1Description: 供应商链接; ComponentLink1URL: http://www.szlcsc.com/product/details_26547.html; Package: 0603; Supplier: LC; SuppliersPartNumber: C25804
R35-R37 = 0603 100Ω (1000) 1%: 贴片电阻; ComponentLink1Description: 供应商链接; ComponentLink1URL: http://www.szlcsc.com/product/details_23502.html; Package: 0603; Supplier: LC; SuppliersPartNumber: C22775

## Nets that join several sheets
+5: VESC_6 (27 pins), CAN (C33.2 U4.3), MCU (15 pins), RV8301 (42 pins), Power (26 pins)
VCC: VESC_6 (7 pins), CAN (C34.2 U4.5), MCU (12 pins), RV8301 (U3.49), Power (10 pins)
NetC1_2: VESC_6 (C1.2 R6.2), MCU (U1.58)
NetC7_2: VESC_6 (P7.1), MCU (C7.2 U1.7)
NetC29_2: MCU (U1.8), Power (C29.2 R35.1)
NetC30_2: MCU (U1.9), Power (C30.2 R36.1)
NetC36_2: MCU (U1.17), Power (C36.2 R27.1 R28.2)
NetC45_2: MCU (U1.10), Power (C45.2 R37.1)
NetC58_1: VESC_6 (C58.1 P4.4 R39.1 R42.2), MCU (U1.37)
NetD2_A: VESC_6 (D2.A), MCU (U1.27)
NetD3_A: VESC_6 (D3.A), MCU (U1.26)
NetP2_2: VESC_6 (P2.2), CAN (R4.1 U4.6)
NetP2_3: VESC_6 (P2.3), CAN (R4.2 U4.7)
NetP4_2: VESC_6 (P4.2 R44.2), MCU (U1.39)
NetP4_3: VESC_6 (P4.3 R43.2), MCU (U1.38)
NetP4_5: VESC_6 (P4.5), MCU (U1.24)
NetP5_4: VESC_6 (P5.4), MCU (U1.21)
NetP5_7: VESC_6 (P5.7), MCU (U1.22)
NetP5_8: VESC_6 (P5.8), MCU (U1.25)
NetP7_2: VESC_6 (P7.2), MCU (U1.46)
NetP7_4: VESC_6 (P7.4), MCU (U1.49)
NetP12_2: VESC_6 (P12.2), MCU (U1.54)
NetP12_3: VESC_6 (P12.3), MCU (U1.55)
NetP12_4: VESC_6 (P12.4), MCU (U1.56)
NetP12_5: VESC_6 (P12.5), MCU (U1.33)
NetR2_2: VESC_6 (R2.2), MCU (U1.44)
NetR3_2: VESC_6 (R3.2), MCU (U1.45)
NetR15_1: MCU (U1.11), RV8301 (R15.1 R16.1)
NetR17_1: MCU (U1.14), RV8301 (R17.1 R18.1)
NetR19_1: MCU (U1.15), RV8301 (R19.1 R20.1)
NetR21_1: MCU (U1.16), RV8301 (R21.1 R22.1)
NetR25_1: RV8301 (U3.47), Power (R25.1)
NetR26_1: RV8301 (U3.45), Power (R26.1)
NetR30_1: RV8301 (U3.42), Power (R30.1)
NetR31_1: RV8301 (U3.40), Power (R31.1)
NetR33_1: RV8301 (U3.37), Power (R33.1)
NetR34_1: RV8301 (U3.35), Power (R34.1)
NetU1_34: MCU (U1.34), RV8301 (U3.18)
NetU1_35: MCU (U1.35), RV8301 (U3.20)
NetU1_36: MCU (U1.36), RV8301 (U3.22)
NetU1_40: MCU (U1.40), RV8301 (U3.8)
NetU1_41: MCU (U1.41), RV8301 (U3.17)
NetU1_42: MCU (U1.42), RV8301 (U3.19)
NetU1_43: MCU (U1.43), RV8301 (U3.21)
NetU1_51: MCU (U1.51), RV8301 (U3.11)
NetU1_52: MCU (U1.52), RV8301 (U3.10)
NetU1_53: MCU (U1.53), RV8301 (U3.9)
NetU1_57: MCU (U1.57), RV8301 (U3.16)
NetU1_59: MCU (U1.59), RV8301 (U3.6)
NetU1_61: CAN (U4.4), MCU (U1.61)
NetU1_62: CAN (U4.1), MCU (U1.62)
RX_SDA_NSS: VESC_6 (P5.5), MCU (U1.20 U1.30)
SH_A: RV8301 (C23.2 R17.2 U3.46), Power (Q1.3 Q2.4 R24.2 U5.8)
SH_B: RV8301 (C24.2 R19.2 U3.41), Power (Q3.3 Q4.4 R29.2 U6.8)
SH_C: RV8301 (C25.2 R21.2 U3.36), Power (Q5.3 Q6.4 R32.2 U7.8)
SUPPLY: VESC_6 (P3.1), RV8301 (6 pins), Power (12 pins)
TX_SCL_MOSI: VESC_6 (P5.6), MCU (U1.23 U1.29)